# Altium schematic sheet dc dc на аккум.SchDoc
size A3; SheetNumber: 4; SheetTotal: 6; Release_Date: yyyy-mm-dd; Language: en; Organization2: Self Driving Group LLC
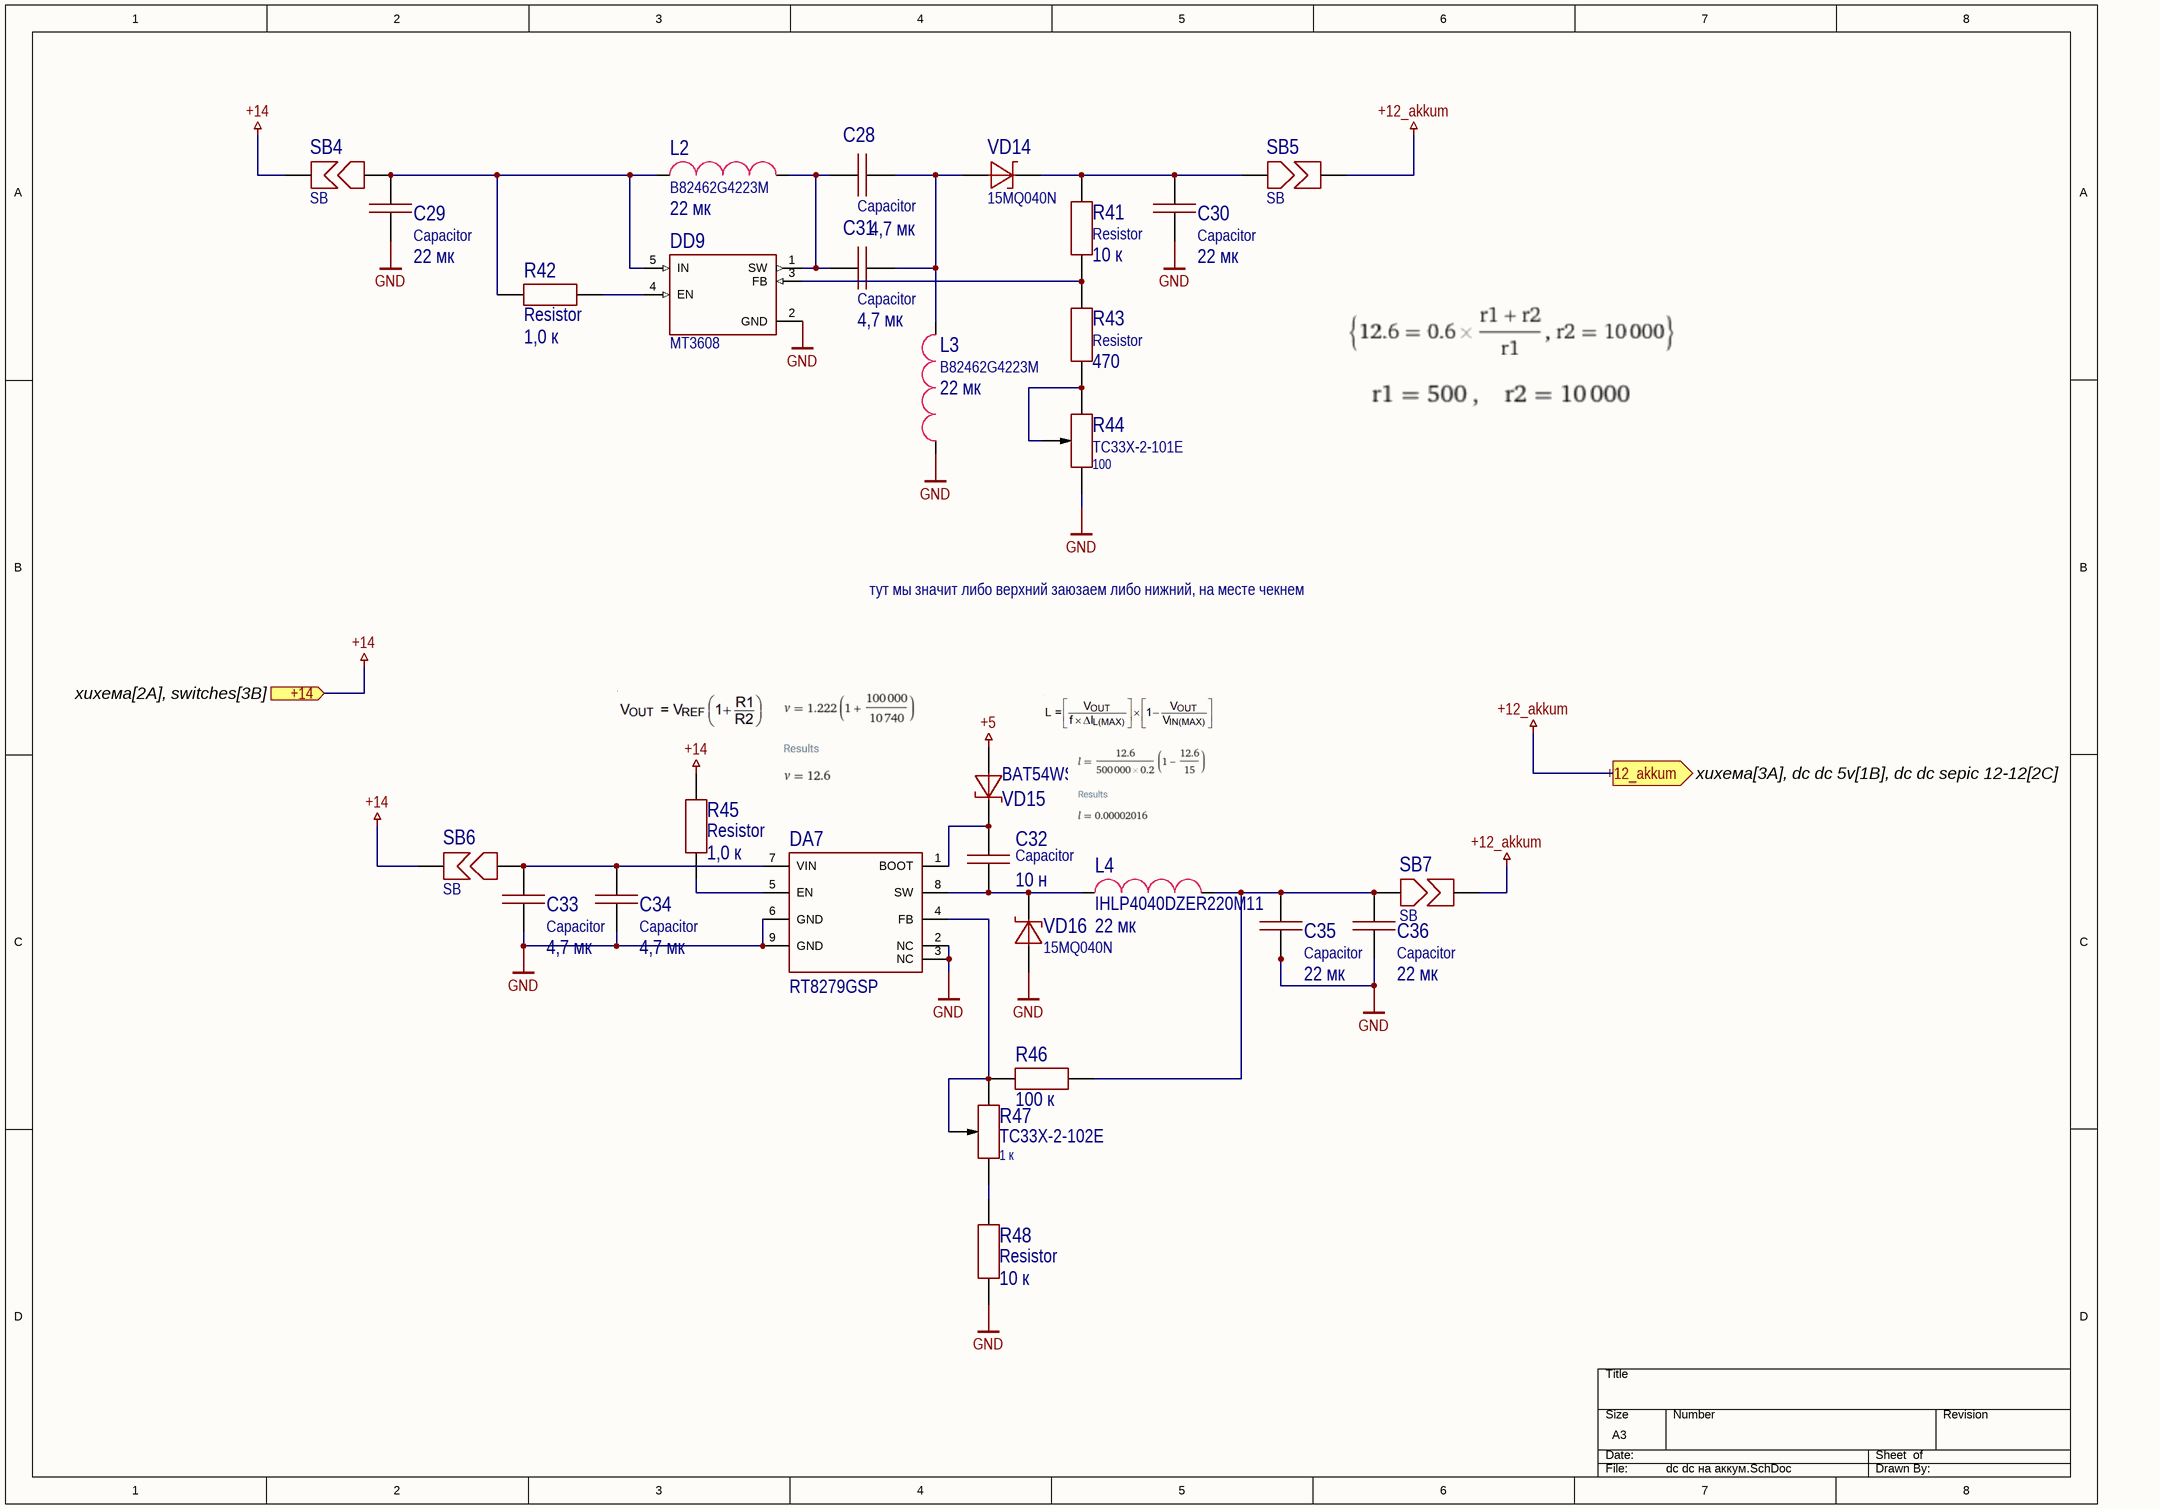
[diagram p0: dc dc на аккум.SchDoc]

## Parts
C28  Capacitor  value 4,7 мк  [1206C]
C29  Capacitor  value 22 мк  [1210C]
C30  Capacitor  value 22 мк  [1210C]
C31  Capacitor  value 4,7 мк  [1206C]
C32  Capacitor  value 10 н  [0603C]
C33  Capacitor  value 4,7 мк  [1206C]
C34  Capacitor  value 4,7 мк  [1206C]
C35  Capacitor  value 22 мк  [1210C]
C36  Capacitor  value 22 мк  [1210C]
DA7  RT8279GSP  [8SOP(Exposed_Pad)]
DD9  MT3608  [SOT23-6]
L2  B82462G4223M  value 22 мк  [B82462G4]
L3  B82462G4223M  value 22 мк  [B82462G4]
L4  IHLP4040DZER220M11  value 22 мк  [IHLP-4040]
R41  Resistor  value 10 к  [0603R]
R42  Resistor  value 1,0 к  [0603R]
R43  Resistor  value 470  [0603R]
R44  TC33X-2-101E  value 100  [3mm_trim]
R45  Resistor  value 1,0 к  [0603R]
R46  value 100 к  [0603R]  (hidden comment: Resistor)
R47  TC33X-2-102E  value 1 к  [3mm_trim]
R48  Resistor  value 10 к  [0603R]
SB4  SB  [1206SB]
SB5  SB  [1206SB]
SB6  SB  [1206SB]
SB7  SB  [1206SB]
VD14  15MQ040N  [SMA]
VD15  BAT54WS  [SOD-323]
VD16  15MQ040N  [SMA]

## Ports
+12_akkum (out, see хихема[3A], dc dc 5v[1B], dc dc sepic 12-12[2C]), +14 (in, see хихема[2A], switches[3B])

## Nets
+5: VD15.1
+12_akkum: SB5.1 SB7.1 ; port +12_akkum
+14: R45.2 SB4.1 SB6.1 ; port +14
GND: C29.1 C30.1 C33.1 C34.1 C35.1 C36.1 DA7.2(NC) DA7.3(NC) DA7.6(GND) DA7.9(GND) DD9.2(GND) L3.1 R44.1 R48.1 VD16.1
NetC28_1: C28.1 C31.1 DD9.1(SW) L2.2
NetC28_2: C28.2 C31.2 L3.2 VD14.1
NetC29_2: C29.2 DD9.5(IN) L2.1 R42.2 SB4.2
NetC30_2: C30.2 R41.2 SB5.2 VD14.2
NetC32_1: C32.1 DA7.8(SW) L4.1 VD16.2
NetC32_2: C32.2 DA7.1(BOOT) VD15.2
NetC33_2: C33.2 C34.2 DA7.7(VIN) SB6.2
NetC35_2: C35.2 C36.2 L4.2 R46.2 SB7.2
NetDA7_4: DA7.4(FB) R46.1 R47.2 R47.3
NetDA7_5: DA7.5(EN) R45.1
NetDD9_3: DD9.3(FB) R41.1 R43.2
NetDD9_4: DD9.4(EN) R42.1
NetR43_1: R43.1 R44.2 R44.3
NetR47_1: R47.1 R48.2

## Notes on the sheet
- тут мы значит либо верхний заюзаем либо нижний, на месте чекнем
- 1
- 2
- 3
- 4
- 5
- 6
- 7
- 8
- A
- B
- C
- D
- E
- Responsible department
- Technical reference
- Document type
- Document status
- F
- Legal owner
- Created by
- Schematic drawing
- Title, Supplementary title
- CONFIDENTIAL
- Yandex
- Commercial secret
- Self Driving Group LLC
- Approved by
- Doc Rev.
- Date of Issue
- Lang.
- Sheet
- A3

## Library data of the parts
C28 C31 C33 C34 = Capacitor_4,7u_10_50V_X7R_1206C: Конденсатор; Tolerance: 0,1; Voltage (V): 50; Dielectric: X7R; Capacity (nF): 4700; Part Number: Capacitor_4,7u_10_50V_X7R_1206C
C29 C30 C35 C36 = Capacitor_22u_10_25V_X7R_1210C: Конденсатор; Tolerance: 0,1; Voltage (V): 25; Dielectric: X7R; Capacity (nF): 22000; Part Number: Capacitor_22u_10_25V_X7R_1210C
C32 = Capacitor_10n_10_50V_X7R_0603C: Конденсатор; Tolerance: 0,1; Voltage (V): 50; Dielectric: X7R; Capacity (nF): 10; Part Number: Capacitor_10n_10_50V_X7R_0603C
DA7 = RT8279GSP: Преобразователь постоянного тока понижающий подстраиваемый выход 5А; Part Number: RT8279GSP
DD9 = MT3608: Повышающий/SEPIC DC-DC преобразователь 2А 1.2МГц; Part Number: MT3608
L2 L3 = B82462G4223M: ЧИП-индуктивность 22мкГн, 1.05A, ±20% катушка; Inductance (μH): 22; Current (A): 1.05; Part Number: B82462G4223M
L4 = IHLP4040DZER220M11: ЧИП-индуктивность экранированная 22мкГн ±20% 5A 66мОм 4040 лента на катушке; Inductance (μH): 22; Current (A): 5; Part Number: IHLP4040DZER220M11
R41 R48 = Resistor_10k_1_0603: Резистор номиналом 10 кОм и точностью 1%; Power: *; Part Number: Resistor_10k_1_0603; Tolerance: 1%
R42 R45 = Resistor_1.0k_1_0603: Резистор номиналом 1,0 кОм и точностью 1%; Power: *; Part Number: Resistor_1.0k_1_0603; Tolerance: 1%
R43 = Resistor_470_1_0603: Резистор номиналом 470 Ом и точностью 1%; Power: *; Part Number: Resistor_470_1_0603; Tolerance: 1%
R44 = TC33X-2-101E: Потенциометр керметный 100 Ом 0.1Вт для поверхностного монтажа; Tolerance: 50%; Part Number: TC33X-2-101E
R46 = Resistor_100k_1_0603: Резистор номиналом 100 кОм и точностью 1%; Power: *; Part Number: Resistor_100k_1_0603; Tolerance: 1%
R47 = TC33X-2-102E: Потенциометр керметный 1кОм 0.1Вт для поверхностного монтажа; Tolerance: 50%; Part Number: TC33X-2-102E
SB4-SB7 = SB: Solder bridge, мост припоя, запаиваемая перемычка, net tie, jumper; Part Number: SB
VD14 VD16 = 15MQ040N: Диод шоттки на 40 В, ном. ток 2.1 А; Voltage nominal (V): 40; Current (A): 2.1; Part Number: 15MQ040N
VD15 = BAT54WS: Диод шоттки на 30 В, ном. ток 0.2 А; Voltage nominal (V): 30; Current (A): 0.2; Part Number: BAT54WS